# Altium schematic sheet Top Level.SchDoc
size A4
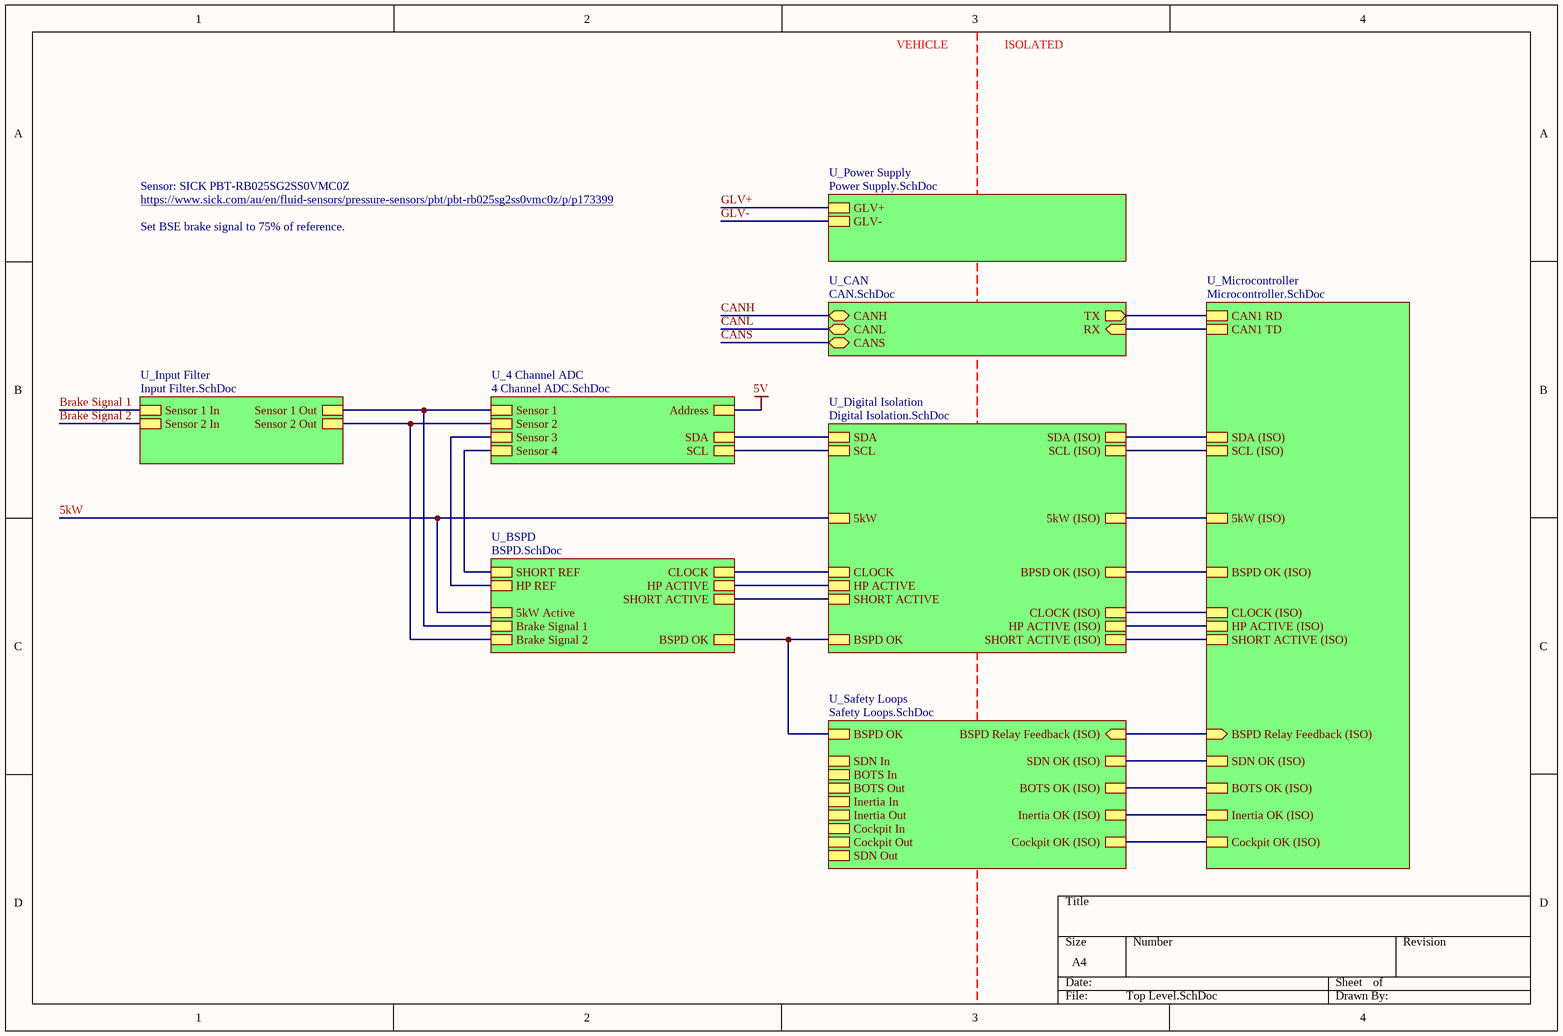
[diagram p0: Top Level.SchDoc]

## Sub-sheets
U_4 Channel ADC = 4 Channel ADC.SchDoc: Address, SCL, SDA, Sensor 1, Sensor 2, Sensor 3, Sensor 4
U_BSPD = BSPD.SchDoc: BSPD OK, HP ACTIVE, SHORT ACTIVE, CLOCK, HP REF, SHORT REF, 5kW Active, Brake Signal 1, Brake Signal 2
U_CAN = CAN.SchDoc: CANS (bidir), RX (in), CANL (bidir), CANH (bidir), TX (out)
U_Digital Isolation = Digital Isolation.SchDoc: SDA (ISO), SCL (ISO), SDA, SCL, CLOCK (ISO), HP ACTIVE (ISO), SHORT ACTIVE (ISO), BPSD OK (ISO), 5kW, 5kW (ISO), BSPD OK, HP ACTIVE, SHORT ACTIVE, CLOCK
U_Input Filter = Input Filter.SchDoc: Sensor 1 In, Sensor 1 Out, Sensor 2 In, Sensor 2 Out
U_Microcontroller = Microcontroller.SchDoc: BSPD OK (ISO), 5kW (ISO), CLOCK (ISO), HP ACTIVE (ISO), SHORT ACTIVE (ISO), SDA (ISO), SCL (ISO), CAN1 RD, CAN1 TD, Cockpit OK (ISO), SDN OK (ISO), BOTS OK (ISO), Inertia OK (ISO), BSPD Relay Feedback (ISO) (in)
U_Power Supply = Power Supply.SchDoc: GLV+, GLV-
U_Safety Loops = Safety Loops.SchDoc: Cockpit OK (ISO), SDN OK (ISO), BOTS OK (ISO), Inertia OK (ISO), BOTS In, Inertia In, Cockpit Out, Cockpit In, Inertia Out, BOTS Out, SDN Out, SDN In, BSPD Relay Feedback (ISO) (in), BSPD OK

## Nets
5V: sheet U_4 Channel ADC/Address
5kW: sheet U_BSPD/5kW Active, sheet U_Digital Isolation/5kW
Brake Signal 1: sheet U_Input Filter/Sensor 1 In
Brake Signal 2: sheet U_Input Filter/Sensor 2 In
CANH: sheet U_CAN/CANH
CANL: sheet U_CAN/CANL
CANS: sheet U_CAN/CANS
GLV+: sheet U_Power Supply/GLV+
GLV-: sheet U_Power Supply/GLV-
(unnamed): sheet U_BSPD/BSPD OK, sheet U_Digital Isolation/BSPD OK, sheet U_Safety Loops/BSPD OK
(unnamed): sheet U_BSPD/HP ACTIVE, sheet U_Digital Isolation/HP ACTIVE
(unnamed): sheet U_BSPD/SHORT ACTIVE, sheet U_Digital Isolation/SHORT ACTIVE
(unnamed): sheet U_BSPD/CLOCK, sheet U_Digital Isolation/CLOCK
(unnamed): sheet U_BSPD/HP REF, sheet U_4 Channel ADC/Sensor 3
(unnamed): sheet U_BSPD/SHORT REF, sheet U_4 Channel ADC/Sensor 4
(unnamed): sheet U_BSPD/Brake Signal 1, sheet U_4 Channel ADC/Sensor 1, sheet U_Input Filter/Sensor 1 Out
(unnamed): sheet U_BSPD/Brake Signal 2, sheet U_4 Channel ADC/Sensor 2, sheet U_Input Filter/Sensor 2 Out
(unnamed): sheet U_4 Channel ADC/SCL, sheet U_Digital Isolation/SCL
(unnamed): sheet U_4 Channel ADC/SDA, sheet U_Digital Isolation/SDA
(unnamed): sheet U_Digital Isolation/SDA (ISO), sheet U_Microcontroller/SDA (ISO)
(unnamed): sheet U_Digital Isolation/SCL (ISO), sheet U_Microcontroller/SCL (ISO)
(unnamed): sheet U_Digital Isolation/CLOCK (ISO), sheet U_Microcontroller/CLOCK (ISO)
(unnamed): sheet U_Digital Isolation/HP ACTIVE (ISO), sheet U_Microcontroller/HP ACTIVE (ISO)
(unnamed): sheet U_Digital Isolation/SHORT ACTIVE (ISO), sheet U_Microcontroller/SHORT ACTIVE (ISO)
(unnamed): sheet U_Digital Isolation/BPSD OK (ISO), sheet U_Microcontroller/BSPD OK (ISO)
(unnamed): sheet U_Digital Isolation/5kW (ISO), sheet U_Microcontroller/5kW (ISO)
(unnamed): sheet U_Microcontroller/CAN1 RD, sheet U_CAN/TX
(unnamed): sheet U_Microcontroller/CAN1 TD, sheet U_CAN/RX
(unnamed): sheet U_Microcontroller/Cockpit OK (ISO), sheet U_Safety Loops/Cockpit OK (ISO)
(unnamed): sheet U_Microcontroller/SDN OK (ISO), sheet U_Safety Loops/SDN OK (ISO)
(unnamed): sheet U_Microcontroller/BOTS OK (ISO), sheet U_Safety Loops/BOTS OK (ISO)
(unnamed): sheet U_Microcontroller/Inertia OK (ISO), sheet U_Safety Loops/Inertia OK (ISO)
(unnamed): sheet U_Microcontroller/BSPD Relay Feedback (ISO), sheet U_Safety Loops/BSPD Relay Feedback (ISO)

## Notes on the sheet
- VEHICLE
- ISOLATED
- Sensor: SICK PBT-RB025SG2SS0VMC0Z
- https://www.sick.com/au/en/fluid-sensors/pressure-sensors/pbt/pbt-rb025sg2ss0vmc0z/p/p173399
- Set BSE brake signal to 75% of reference.